# Altium schematic sheet transmitter.SchDoc
size A
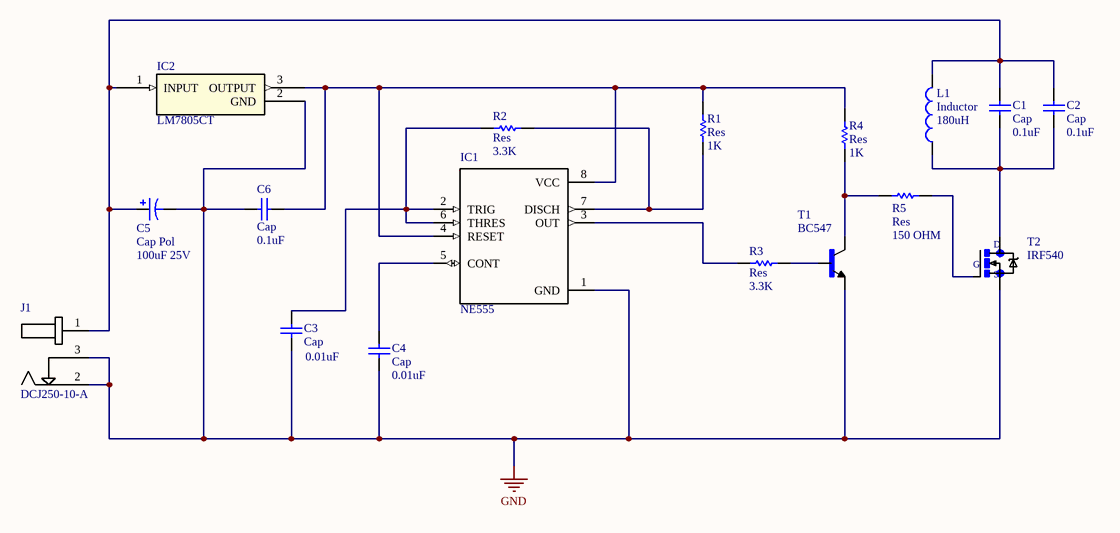
[diagram p0: transmitter.SchDoc]

## Parts
C1  Cap  value 0.1uF  [RAD-0.3]
C2  Cap  value 0.1uF  [RAD-0.3]
C3  Cap  value 0.01uF  [RAD-0.3]
C4  Cap  value 0.01uF  [RAD-0.3]
C5  Cap Pol  value 100uF 25V  [RB7.6-15]
C6  Cap  value 0.1uF  [RAD-0.3]
IC1  NE555  [DIP8]
IC2  LM7805CT  [TO-220]
J1  DCJ250-10-A  [DCJ250-10-A_XX-X_revA]
L1  Inductor  value 180uH  [HDR1X2]
R1  Res  value 1K  [AXIAL-0.3]
R2  Res  value 3.3K  [AXIAL-0.3]
R3  Res  value 3.3K  [AXIAL-0.3]
R4  Res  value 1K  [AXIAL-0.3]
R5  Res  value 150 OHM  [AXIAL-0.3]
T1  BC547  [TO-92]
T2  IRF540  [TO220BV_IRF540(Primary)]

## Nets
GND: C3.1 C4.1 C5.2 C6.2 IC1.1(GND) IC2.2(GND) J1.2 J1.3 T1.1(E) T2.S
NetC1_1: C1.1 C2.1 L1.1 T2.D
NetC1_2: C1.2 C2.2 C5.1 IC2.1(INPUT) J1.1 L1.2
NetC3_2: C3.2 IC1.2(TRIG) IC1.6(THRES) R2.1
NetC4_2: C4.2 IC1.5(CONT)
NetC6_1: C6.1 IC1.4(RESET) IC1.8(VCC) IC2.3(OUTPUT) R1.2 R4.2
NetIC1_3: IC1.3(OUT) R3.1
NetIC1_7: IC1.7(DISCH) R1.1 R2.2
NetR3_2: R3.2 T1.2(B)
NetR4_1: R4.1 R5.1 T1.3(C)
NetR5_2: R5.2 T2.G

## Library data of the parts
C1-C4 C6 = Cap: Capacitor; Published: 8-Jun-2000; LatestRevisionDate: 17-Jul-2002; LatestRevisionNote: Re-released for DXP Platform.; PackageReference: RAD-0.3; Publisher: Altium Limited; PackageDescription: Radial Cap, Thru-Hole; 2 Leads; 0.3 in Pin Spacing
C5 = Cap Pol1: Polarized Capacitor (Radial); Published: 8-Jun-2000; LatestRevisionDate: 17-Jul-2002; LatestRevisionNote: Re-released for DXP Platform.; PackageReference: RB7.6-15; Publisher: Altium Limited; PackageDescription: Polarized Capacitor (Radial); 2 Leads
IC1 = NE555: Precision timing circuits capable of producing accurate time delays or oscillation; MF: Texas Instruments; Package: DIP-8 Texas Instruments; Price: None; MP: NE555; SnapEDA_Link: https://www.snapeda.com/parts/NE555/Texas%20Instruments/view-part/?ref=snap; Availability: Unavailable; Value: *
IC2 = LM7805CT: Imported; Vendor: Fairchild Semiconductor; Built_By: EMA_UL_Team; C: Copyright (C) 2015 Accelerated Designs. All rights reserved; Manufacturer_Part_Number: LM7805CT; RefDes: RefDes; Type: DEV; Value: Value
J1 = DCJ250-10-A_XX-X_revA: DC Power Jack, Thru-Hole, Horizontal, with Locating Pegs, D2.5mm
L1 = Inductor: Code_IEC: 1005; Published: 8-Jun-2000; LatestRevisionDate: 29-May-2009; LatestRevisionNote: IPC-7351 Footprint Added.; PackageReference: 0402-A; Publisher: Altium Limited; PackageDescription: Chip Inductor; Code_JEITA: 0402
R1-R5 = Res1: Resistor; Published: 8-Jun-2000; LatestRevisionDate: 17-Jul-2002; LatestRevisionNote: Re-released for DXP Platform.; PackageReference: AXIAL-0.3; Publisher: Altium Limited; PackageDescription: Axial Device, Thru-Hole; 2 Leads; 0.3 in Pin Spacing
T1 = BC547: Transistor NPN BC547 PHILIPS miliampere=100 TO92; MF: ON Semiconductor; Price: None; SnapEDA_Link: https://www.snapeda.com/parts/BC547/ON%20Semiconductor/view-part/?ref=snap; Availability: Unavailable; MP: BC547; Package: TO-92 Rochester Electronics; Value: *
T2 = IRF540: MF: Vishay Siliconix; Package: TO-220 ON Semiconductor; MP: IRF540; Price: None; Availability: Unavailable; SnapEDA_Link: https://www.snapeda.com/parts/IRF540/Vishay%20Siliconix/view-part/?ref=snap; Value: *